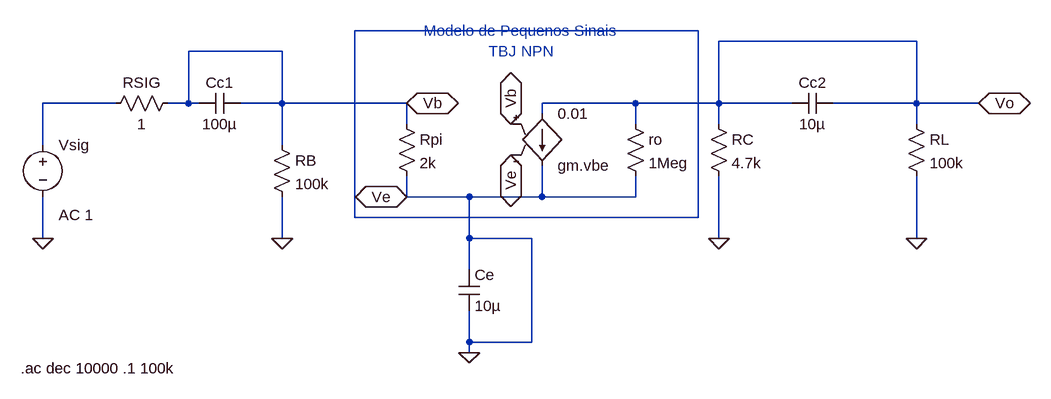
[diagram p0: schematic Emissor_Comum_Baixas_Frequencias.asc]
Emissor_Comum_Baixas_Frequencias.asc, the LTspice schematic file:
Version 4
SHEET 1 1560 680
WIRE 1040 -32 512 -32
WIRE 1376 -16 1072 -16
WIRE 400 0 256 0
WIRE 144 80 32 80
WIRE 256 80 256 0
WIRE 256 80 224 80
WIRE 272 80 256 80
WIRE 400 80 400 0
WIRE 400 80 336 80
WIRE 592 80 400 80
WIRE 944 80 800 80
WIRE 1072 80 1072 -16
WIRE 1072 80 944 80
WIRE 1184 80 1072 80
WIRE 1376 80 1376 -16
WIRE 1376 80 1248 80
WIRE 1472 80 1376 80
WIRE 800 96 800 80
WIRE 592 112 592 80
WIRE 944 112 944 80
WIRE 1072 112 1072 80
WIRE 1376 112 1376 80
WIRE 32 144 32 80
WIRE 400 144 400 80
WIRE 592 224 592 192
WIRE 688 224 592 224
WIRE 800 224 800 176
WIRE 800 224 688 224
WIRE 944 224 944 192
WIRE 944 224 800 224
WIRE 512 256 512 -32
WIRE 1040 256 1040 -32
WIRE 1040 256 512 256
WIRE 32 288 32 224
WIRE 400 288 400 224
WIRE 688 288 688 224
WIRE 784 288 688 288
WIRE 1072 288 1072 192
WIRE 1376 288 1376 192
WIRE 688 336 688 288
WIRE 688 448 688 400
WIRE 784 448 784 288
WIRE 784 448 688 448
WIRE 688 464 688 448
FLAG 32 288 0
FLAG 400 288 0
FLAG 688 464 0
FLAG 752 112 Vb
IOPIN 752 112 BiDir
FLAG 752 160 Ve
IOPIN 752 160 BiDir
FLAG 592 80 Vb
IOPIN 592 80 BiDir
FLAG 592 224 Ve
IOPIN 592 224 BiDir
FLAG 1072 288 0
FLAG 1376 288 0
FLAG 1472 80 Vo
IOPIN 1472 80 BiDir
SYMBOL voltage 32 128 R0
WINDOW 123 24 124 Left 2
WINDOW 39 0 0 Left 0
SYMATTR Value2 AC 1
SYMATTR InstName Vsig
SYMATTR Value ""
SYMBOL res 240 64 R90
WINDOW 0 0 56 VBottom 2
WINDOW 3 32 56 VTop 2
SYMATTR InstName RSIG
SYMATTR Value 1
SYMBOL cap 336 64 R90
WINDOW 0 0 32 VBottom 2
WINDOW 3 32 32 VTop 2
SYMATTR InstName Cc1
SYMATTR Value 100µ
SYMBOL res 384 128 R0
SYMATTR InstName RB
SYMATTR Value 100k
SYMBOL cap 672 336 R0
SYMATTR InstName Ce
SYMATTR Value 10µ
SYMBOL res 1056 96 R0
SYMATTR InstName RC
SYMATTR Value 4.7k
SYMBOL res 1360 96 R0
SYMATTR InstName RL
SYMATTR Value 100k
SYMBOL res 928 96 R0
SYMATTR InstName ro
SYMATTR Value 1Meg
SYMBOL cap 1248 64 R90
WINDOW 0 0 32 VBottom 2
WINDOW 3 32 32 VTop 2
SYMATTR InstName Cc2
SYMATTR Value 10µ
SYMBOL res 576 96 R0
SYMATTR InstName Rpi
SYMATTR Value 2k
SYMBOL g2 800 192 M180
SYMATTR InstName gm.vbe
SYMATTR Value 0.01
TEXT 768 -16 Center 2 ;Modelo de Pequenos Sinais\nTBJ NPN
TEXT -2 488 Left 2 !.ac dec 10000 .1 100k

The netlist it stands for:
* Emissor_Comum_Baixas_Frequencias.asc
Vsig N002 0 AC 1
RSIG Vb N002 1
Cc1 Vb Vb 100µ
RB Vb 0 100k
Ce 0 0 10µ
RC Vo 0 4.7k
RL Vo 0 100k
ro Vo 0 1Meg
Cc2 Vo Vo 10µ
Rpi Vb 0 2k
gm.vbe Vo 0 Vb 0 0.01
* Modelo de Pequenos Sinais
* TBJ NPN
.ac dec 10000 .1 100k
.backanno
.end